# Altium schematic sheet TAS5822.SchDoc
size A3; PageSetup: Record=PageOptions|CenterHorizontal=True|CenterVertical=True|PrintScale=0.68|XCorrection=1.00|YCorrection=1.00|PrintKind=1|BorderSize=5000000|LeftOffset=0|BottomOffset=0|Orientation=2|PaperLength=1000|PaperWidth=1000|Scale=100|PaperSource=7|PrintQuality=-4|MediaType=1|DitherType=10|PrintScaleMode=1|PaperKind=A3
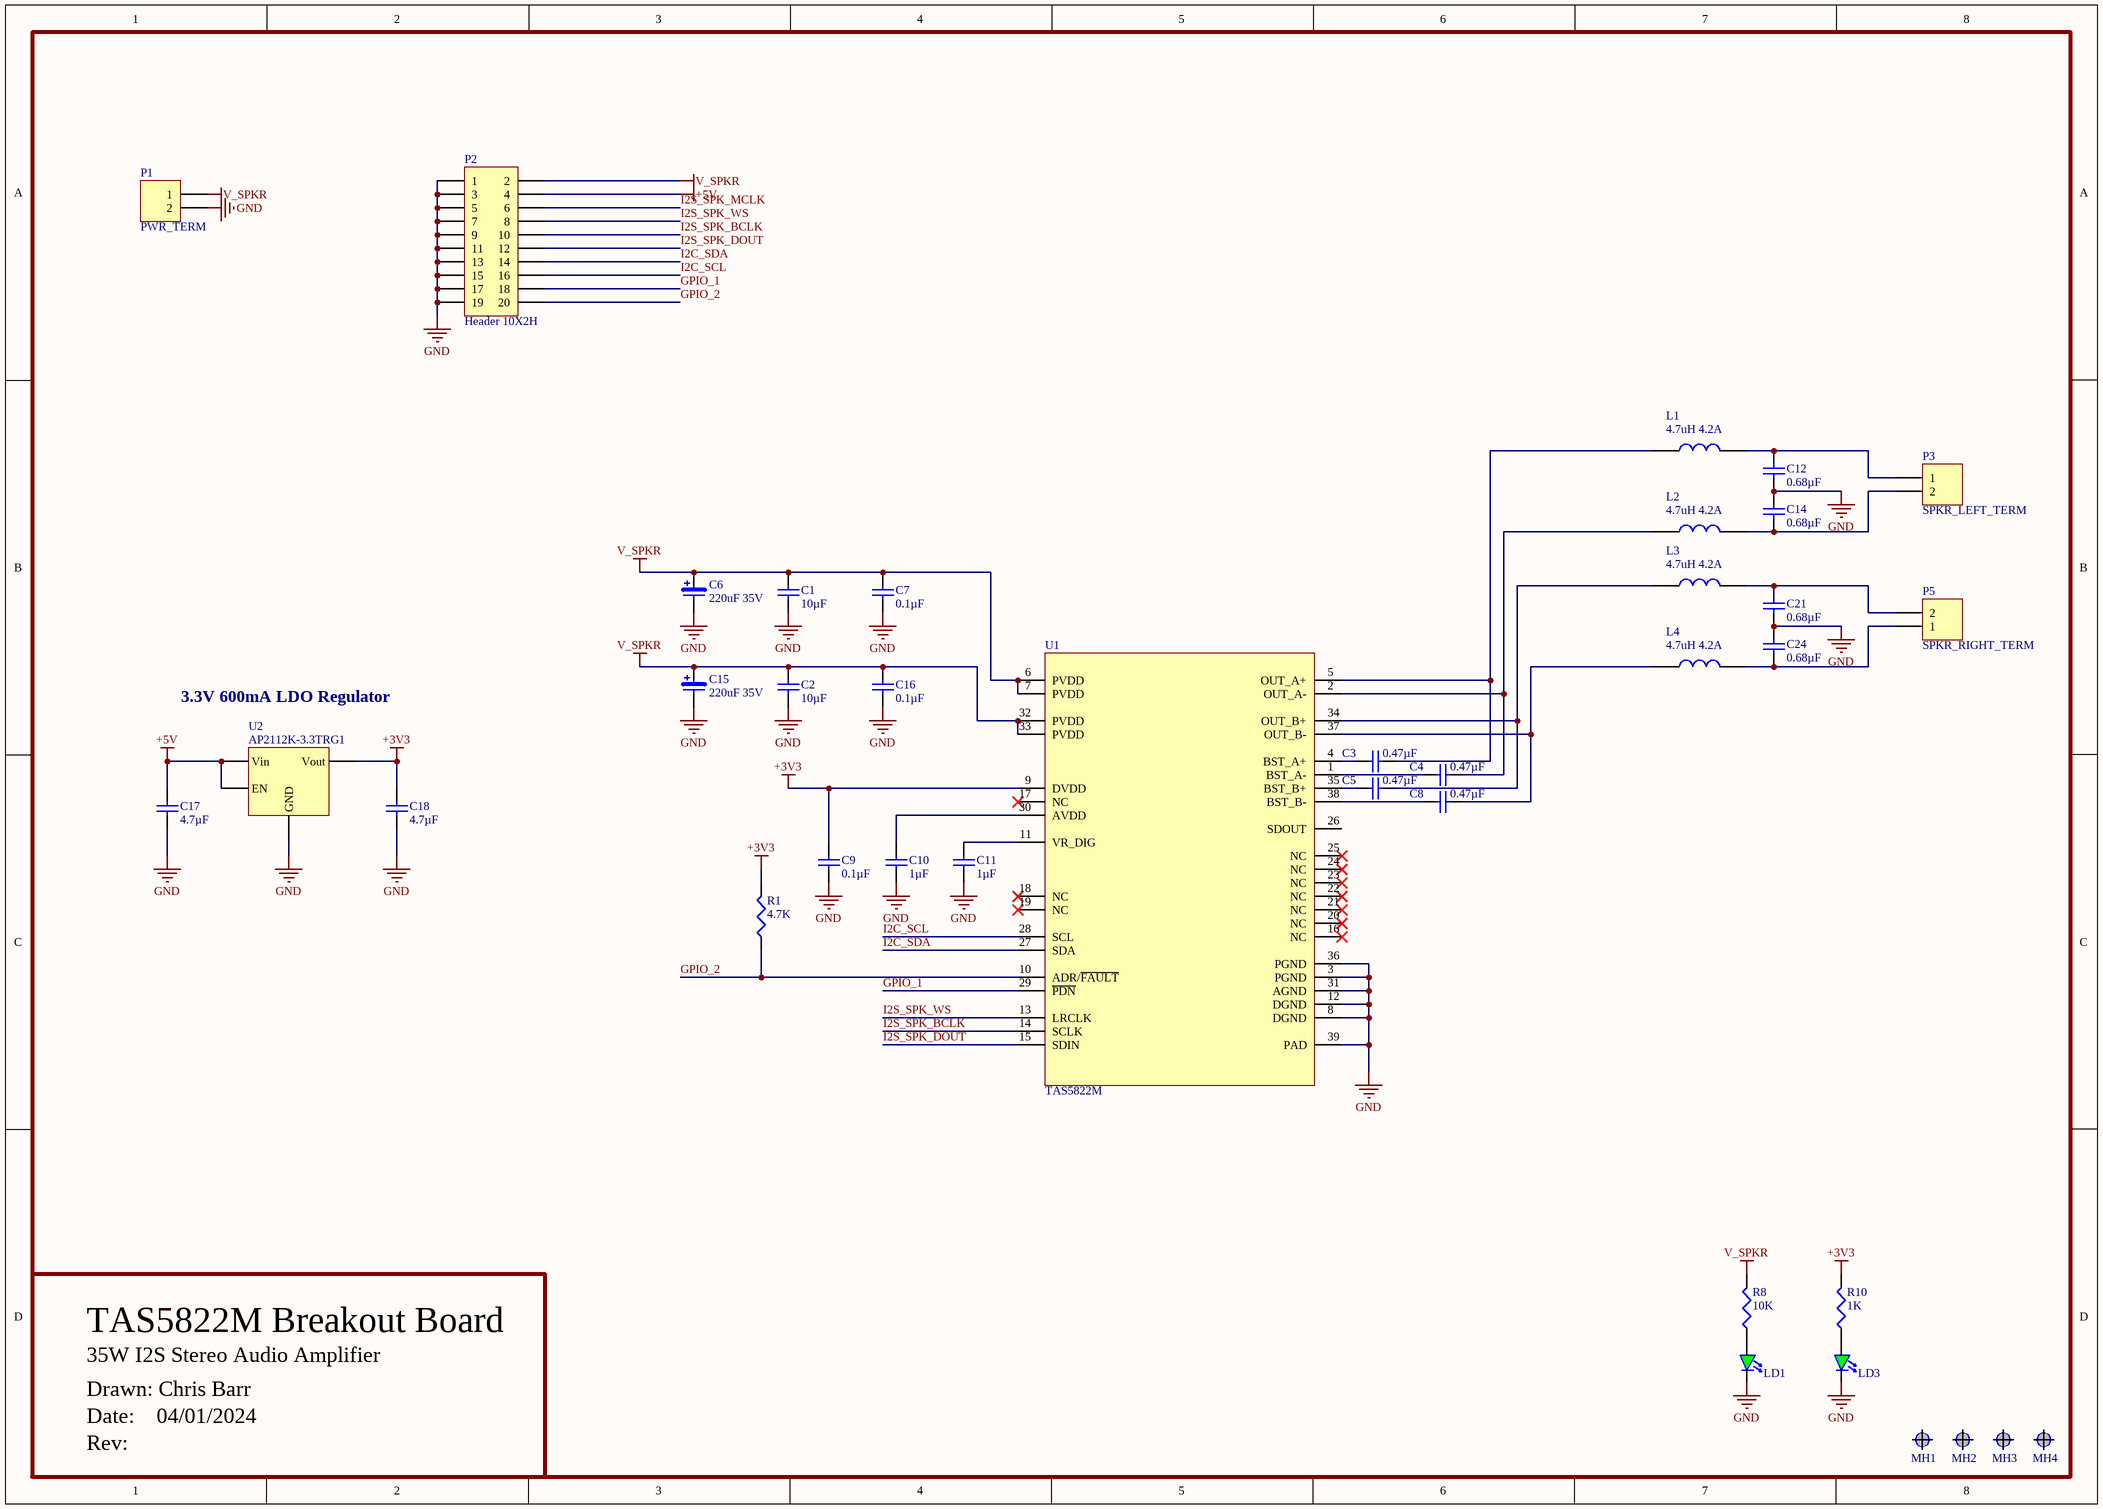
[diagram p0: TAS5822.SchDoc]

## Parts
C1  value 10µF  [CAPC3216X100N]  (hidden comment: Capacitor)
C2  value 10µF  [CAPC3216X100N]  (hidden comment: Capacitor)
C3  value 0.47µF  [CAPC1608X90N]  (hidden comment: Capacitor)
C4  value 0.47µF  [CAPC1608X90N]  (hidden comment: Capacitor)
C5  value 0.47µF  [CAPC1608X90N]  (hidden comment: Capacitor)
C6  value 220uF 35V  [CAPAE250P680X1220_VERT]  (hidden comment: CapE-8.0-THT-220uF-35V)
C7  value 0.1µF  [CAPC1608X90N]  (hidden comment: Capacitor)
C8  value 0.47µF  [CAPC1608X90N]  (hidden comment: Capacitor)
C9  value 0.1µF  [CAPC1608X90N]  (hidden comment: Capacitor)
C10  value 1µF  [CAPC1608X90N]  (hidden comment: Capacitor)
C11  value 1µF  [CAPC1608X90N]  (hidden comment: Capacitor)
C12  value 0.68µF  [CAPC3216X100N]  (hidden comment: Capacitor)
C14  value 0.68µF  [CAPC3216X100N]  (hidden comment: Capacitor)
C15  value 220uF 35V  [CAPAE250P680X1220_VERT]  (hidden comment: CapE-8.0-THT-220uF-35V)
C16  value 0.1µF  [CAPC1608X90N]  (hidden comment: Capacitor)
C17  value 4.7µF  [CAPC1608X90N]  (hidden comment: Capacitor)
C18  value 4.7µF  [CAPC1608X90N]  (hidden comment: Capacitor)
C21  value 0.68µF  [CAPC3216X100N]  (hidden comment: Capacitor)
C24  value 0.68µF  [CAPC3216X100N]  (hidden comment: Capacitor)
L1  value 4.7uH 4.2A  [SRN6045TA SMD Inductor]  (hidden comment: Inductor SMD 10uH 2.4A)
L2  value 4.7uH 4.2A  [SRN6045TA SMD Inductor]  (hidden comment: Inductor SMD 10uH 2.4A)
L3  value 4.7uH 4.2A  [SRN6045TA SMD Inductor]  (hidden comment: Inductor SMD 10uH 2.4A)
L4  value 4.7uH 4.2A  [SRN6045TA SMD Inductor]  (hidden comment: Inductor SMD 10uH 2.4A)
LD1  LEDG  0603  [LED 1608-0603]  (value not drawn)
LD3  LEDG  0603  [LED 1608-0603]  (value not drawn)
MH1  Screw Hole  [M3-Hole-2]  (value not drawn)  (no BOM)
MH2  Screw Hole  [M3-Hole-2]  (value not drawn)  (no BOM)
MH3  Screw Hole  [M3-Hole-2]  (value not drawn)  (no BOM)
MH4  Screw Hole  [M3-Hole-2]  (value not drawn)  (no BOM)
P1  PWR_TERM  [TERM2 3.5mm]  (no BOM)
P2  Header 10X2H  [HDR2X10H]
P3  SPKR_LEFT_TERM  [TERM2 3.5mm]  (no BOM)
P5  SPKR_RIGHT_TERM  [TERM2 3.5mm]  (no BOM)
R1  value 4.7K  [RES 1608-0603]  (hidden comment: Resistor)
R8  value 10K  [RES 1608-0603]  (hidden comment: Resistor)
R10  value 1K  [RES 1608-0603]  (hidden comment: Resistor)
U1  TAS5822M  [TSSOP50P640X120_HS-39N]
U2  AP2112K-3.3TRG1  [SOT23-5]

## Nets
+3V3: C9.2 C18.2 R1.2 R10.2 U1.9(DVDD) U2.5(Vout)
+5V: C17.2 P2.4 U2.1(Vin) U2.3(EN)
GND: C1.1 C2.1 C6.2 C7.1 C9.1 C10.1 C11.1 C12.1 C14.2 C15.2 C16.1 C17.1 C18.1 C21.1 C24.2 LD1.2(K) LD3.2(K) P1.2 P2.1 P2.3 P2.5 P2.7 P2.9 P2.11 P2.13 P2.15 P2.17 P2.19 U1.3(PGND) U1.8(DGND) U1.12(DGND) U1.31(AGND) U1.36(PGND) U1.39(PAD) U2.2(GND)
V_SPKR: C1.2 C2.2 C6.1 C7.2 C15.1 C16.2 P1.1 P2.2 R8.2 U1.6(PVDD) U1.7(PVDD) U1.32(PVDD) U1.33(PVDD)
GPIO_1: P2.18 U1.29(~{PDN})
GPIO_2: P2.20 R1.1 U1.10(ADR/~{FAULT})
I2C_SCL: P2.16 U1.28(SCL)
I2C_SDA: P2.14 U1.27(SDA)
I2S_SPK_BCLK: P2.10 U1.14(SCLK)
I2S_SPK_DOUT: P2.12 U1.15(SDIN)
I2S_SPK_MCLK: P2.6
I2S_SPK_WS: P2.8 U1.13(LRCLK)
NetC3_1: C3.1 U1.4(BST_A+)
NetC3_2: C3.2 L1.1 U1.5(OUT_A+)
NetC4_1: C4.1 U1.1(BST_A-)
NetC4_2: C4.2 L2.1 U1.2(OUT_A-)
NetC5_1: C5.1 U1.35(BST_B+)
NetC5_2: C5.2 L3.1 U1.34(OUT_B+)
NetC8_1: C8.1 U1.38(BST_B-)
NetC8_2: C8.2 L4.1 U1.37(OUT_B-)
NetC10_2: C10.2 U1.30(AVDD)
NetC11_2: C11.2 U1.11(VR_DIG)
NetC12_2: C12.2 L1.2 P3.1
NetC14_1: C14.1 L2.2 P3.2
NetC21_2: C21.2 L3.2 P5.2
NetC24_1: C24.1 L4.2 P5.1
NetLD1_1: LD1.1(A) R8.1
NetLD3_1: LD3.1(A) R10.1

Not connected (* = marked no-connect by the designer): MH1 M3(0); MH2 M3(0); MH3 M3(0); MH4 M3(0); U1 16(NC)* 17(NC)* 18(NC)* 19(NC)* 20(NC)* 21(NC)* 22(NC)* 23(NC)* 24(NC)* 25(NC)* 26(SDOUT)

## Notes on the sheet
- 3.3V 600mA LDO Regulator
- TAS5822M Breakout Board
- Drawn: Chris Barr
- 35W I2S Stereo Audio Amplifier
- Date:    04/01/2024
- Rev:
- Title
- Size:
- Date:
- File:
- A1
- Number:
- Time:
- Revision:
- Sheet
- of

## Library data of the parts
C1 C2 = GMK316BBJ106MLHT: CAP CER 10UF 35V X5R 1206; Manufacturer 1: Taiyo Yuden; Note: Approved sub OK; Tolerance: ±20%; Revision: July-2002: Re-released for DXP Platform.; Voltage: 35V; Supplier 1: Digi-Key; Supplier Part Number 1: 587-4898-1-ND; Package: 0402; Type: X5R; Manufacturer Part Number 1: GMK316BBJ106MLHT; Temperature Coefficient: X5R; Operating Temperature: -55°C ~ 85°C; Package / Case: 1206 (3216 Metric); Size / Dimension: 0.126" L x 0.063" W (3.20mm x 1.60mm); Thickness (Max): 0.075" (1.90mm)
C3-C5 C8 = GMJ107BB7474KAHT: CAP CER 0.47UF 35V X7R 0603; Manufacturer 1: Taiyo Yuden; Note: Approved sub OK; Tolerance: ±10%; Type: X5R; Revision: July-2002: Re-released for DXP Platform.; Voltage: 35V; Supplier 1: Digi-Key; Supplier Part Number 1: 587-4355-1-ND; Package: 0402; Manufacturer Part Number 1: GMJ107BB7474KAHT; Temperature Coefficient: X7R; Operating Temperature: -55°C ~ 125°C; Package / Case: 0603 (1608 Metric); Size / Dimension: 0.063" L x 0.031" W (1.60mm x 0.80mm); Thickness (Max): 0.035" (0.90mm)
C6 C15 = CapE-8.0-THT-220uF-35V: CAP ALUM 220UF 20% 35V RADIAL; Note: Approved sub OK; Published: 8-Jun-2000; Revision: July-2002: Re-released for DXP Platform.; Publisher: Altium Limited; Supplier 1: Digi-Key; Supplier Part Number 1: 732-8946-1-ND
C7 C9 C16 = UMJ107BB7104KAHT: CAP CER 0.1UF 50V X7R 0603; Manufacturer 1: Taiyo Yuden; Note: Approved sub OK; Tolerance: ±10%; Type: X5R; Revision: July-2002: Re-released for DXP Platform.; Voltage: 50V; Supplier 1: Digi-Key; Supplier Part Number 1: 587-4474-1-ND; Package: 0402; Manufacturer Part Number 1: UMJ107BB7104KAHT; Temperature Coefficient: X7R; Operating Temperature: -55°C ~ 125°C; Package / Case: 0603 (1608 Metric); Size / Dimension: 0.063" L x 0.031" W (1.60mm x 0.80mm); Thickness (Max): 0.039" (1.00mm)
C10 C11 = GMK107BJ105KAHT: CAP CER 1UF 35V X5R 0603; Manufacturer 1: Taiyo Yuden; Note: Approved sub OK; Tolerance: ±10%; Revision: July-2002: Re-released for DXP Platform.; Voltage: 35V; Supplier 1: Digi-Key; Supplier Part Number 1: 587-3358-1-ND; Package: 0402; Type: X5R; Manufacturer Part Number 1: GMK107BJ105KAHT; Temperature Coefficient: X5R; Operating Temperature: -55°C ~ 85°C; Package / Case: 0603 (1608 Metric); Size / Dimension: 0.063" L x 0.031" W (1.60mm x 0.80mm); Thickness (Max): 0.035" (0.90mm)
C12 C14 C21 C24 = C3216X7R2A684K160AA: CAP CER 0.68UF 100V X7R 1206; Manufacturer 1: TDK Corporation; Note: Approved sub OK; Tolerance: ±10%; Type: X5R; Revision: July-2002: Re-released for DXP Platform.; Voltage: 100V; Supplier 1: Digi-Key; Supplier Part Number 1: 445-14810-1-ND; Package: 0402; Manufacturer Part Number 1: C3216X7R2A684K160AA; Temperature Coefficient: X7R; Operating Temperature: -55°C ~ 125°C; Package / Case: 1206 (3216 Metric); Size / Dimension: 0.126" L x 0.063" W (3.20mm x 1.60mm); Thickness (Max): 0.071" (1.80mm)
C17 C18 = C1608X5R1C475K080AC: CAP CER 4.7UF 16V X5R 0603; Manufacturer 1: TDK Corporation; Note: Approved sub OK; Tolerance: ±10%; Revision: July-2002: Re-released for DXP Platform.; Voltage: 16V; Supplier 1: Digi-Key; Supplier Part Number 1: 445-7478-1-ND; Package: 0402; Type: X5R; Manufacturer Part Number 1: C1608X5R1C475K080AC; Temperature Coefficient: X5R; Operating Temperature: -55°C ~ 85°C; Package / Case: 0603 (1608 Metric); Size / Dimension: 0.063" L x 0.031" W (1.60mm x 0.80mm); Thickness (Max): 0.035" (0.90mm)
L1-L4 = Inductor SMD 33uH 2.5A: FIXED IND 4.7UH 4.2A 35 MOHM SMD; Published: 24-Mar-1999; Revision: July-2002: Re-released for DXP Platform.; Publisher: Altium Limited; Supplier 1: Digikey; Supplier Part Number 1: 445-173055-1-ND
LD1 LD3 = LEDG  0603: LED GREEN CLEAR CHIP SMD 0603; Note: Approved sub OK; Supplier 1: Digi-Key; Supplier Part Number 1: 160-1435-2-ND
P1 P3 P5 = ScrewTerminal-3.5mm-2Way: Screw Terminal 3.5mm 2-Way; Note: Approved sub OK; Supplier 1: Digi-Key; Supplier Part Number 1: 277-5719-ND
P2 = Header 10X2H: Header, 10-Pin, Dual row, Right Angle; Manufacturer 1: Generic Header; Note: Approved sub OK; LatestRevisionDate: 17-Jul-2002; LatestRevisionNote: Re-released for DXP Platform.; Publisher: Altium Limited
R1 = RC0603FR-074K7L: RES SMD 4.7K OHM 1% 1/10W 0603; Manufacturer 1: Yageo; Note: Approved sub OK; Power (Watts): 0.1W, 1/10W; Temperature Coefficient: ±100ppm/°C; Published: 8-Jun-2000; Revision: July-2002: Re-released for DXP Platform.; Publisher: Altium Limited; Supplier 1: Digi-Key; Supplier Part Number 1: 311-4.70KHRCT-ND; Manufacturer Part Number 1: RC0603FR-074K7L; Tolerance: ±1%; Composition: Thick Film; Features: Moisture Resistant; Operating Temperature: -55°C ~ 155°C; Package / Case: 0603 (1608 Metric); Size / Dimension: 0.063" L x 0.031" W (1.60mm x 0.80mm); Height - Seated (Max): 0.022" (0.55mm)
R8 = RC0603FR-0710KL: RES SMD 10K OHM 1% 1/10W 0603; Manufacturer 1: Yageo; Note: Approved sub OK; Power (Watts): 0.1W, 1/10W; Temperature Coefficient: ±100ppm/°C; Published: 8-Jun-2000; Revision: July-2002: Re-released for DXP Platform.; Publisher: Altium Limited; Supplier 1: Digi-Key; Supplier Part Number 1: 311-10.0KHRCT-ND; Manufacturer Part Number 1: RC0603FR-0710KL; Tolerance: ±1%; Composition: Thick Film; Features: Moisture Resistant; Operating Temperature: -55°C ~ 155°C; Package / Case: 0603 (1608 Metric); Size / Dimension: 0.063" L x 0.031" W (1.60mm x 0.80mm); Height - Seated (Max): 0.022" (0.55mm)
R10 = RC0603FR-071KL: RES SMD 1K OHM 1% 1/10W 0603; Manufacturer 1: Yageo; Note: Approved sub OK; Power (Watts): 0.1W, 1/10W; Temperature Coefficient: ±100ppm/°C; Published: 8-Jun-2000; Revision: July-2002: Re-released for DXP Platform.; Publisher: Altium Limited; Supplier 1: Digi-Key; Supplier Part Number 1: 311-1.00KHRCT-ND; Manufacturer Part Number 1: RC0603FR-071KL; Tolerance: ±1%; Composition: Thick Film; Features: Moisture Resistant; Operating Temperature: -55°C ~ 155°C; Package / Case: 0603 (1608 Metric); Size / Dimension: 0.063" L x 0.031" W (1.60mm x 0.80mm); Height - Seated (Max): 0.022" (0.55mm)
U1 = IC - DAC, I2S Amplifier - TAS5822M: 35-W, INDUCTOR-LESS, DIGITAL INP; Supplier 1: Digikey; Supplier Part Number 1: 296-TAS5822MDCPRCT-ND
U2 = Regulator - AP2112K 3.3V Linear Regulator: IC REG LINEAR 3.3V 600MA SOT25; Manufacturer 1: Diodes Incorporated; Supplier 1: Digi-Key; Supplier Part Number 1: AP2112K-3.3TRG1DICT-ND; Manufacturer Part Number 1: AP2112K-3.3TRG1